# Altium schematic sheet Sheet1.SchDoc
size A4
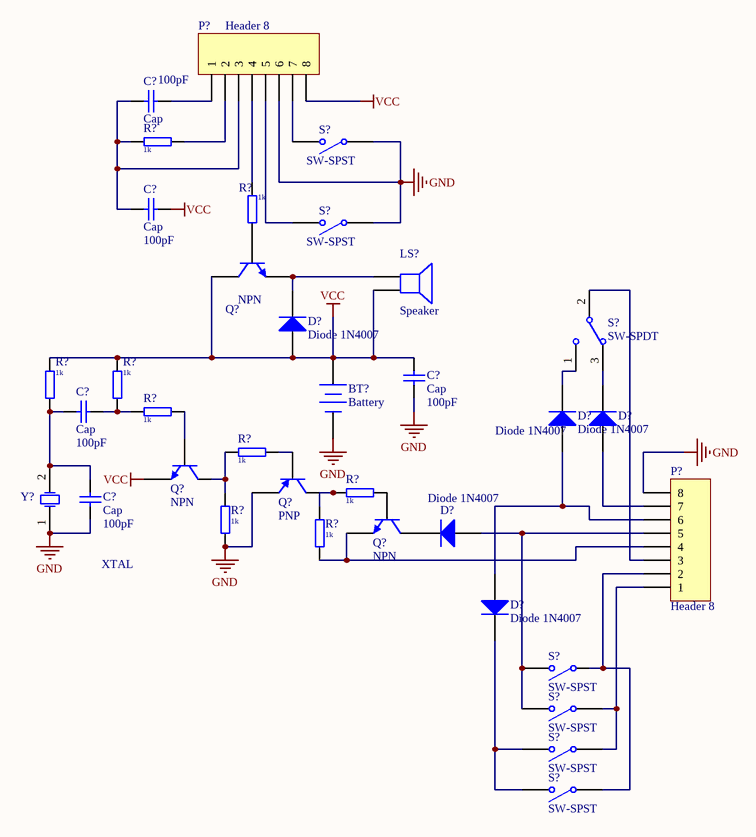
[diagram p0: Sheet1.SchDoc]

## Parts
(Parts that share a designator on the sheet are numbered #1, #2 ... from top to bottom, then left to right.)
BT?  Battery  [BAT-2]
C?#1  Cap  value 100pF  [RAD-0.3]
C?#2  Cap  value 100pF  [RAD-0.3]
C?#3  Cap  value 100pF  [RAD-0.3]
C?#4  Cap  value 100pF  [RAD-0.3]
C?#5  Cap  value 100pF  [RAD-0.3]
D?#1  Diode 1N4007  [DO-41]
D?#2  Diode 1N4007  [DO-41]
D?#3  Diode 1N4007  [DO-41]
D?#4  Diode 1N4007  [DO-41]
D?#5  Diode 1N4007  [DO-41]
LS?  Speaker  [PIN2]
P?#1  Header 8  [HDR1X8]
P?#2  Header 8  [HDR1X8]
Q?#1  NPN  [TO-226-AA]
Q?#2  NPN  [TO-226-AA]
Q?#3  PNP  [SOT-23B_L]
Q?#4  NPN  [TO-226-AA]
R?#1  1k  [R0805]
R?#2  1k  [R0805]
R?#3  1k  [R0805]
R?#4  1k  [R0805]
R?#5  1k  [R0805]
R?#6  1k  [R0805]
R?#7  1k  [R0805]
R?#8  1k  [R0805]
R?#9  1k  [R0805]
S?#1  SW-SPST  [SPST-2]
S?#2  SW-SPST  [SPST-2]
S?#3  SW-SPDT  [TL36WW15050]
S?#4  SW-SPST  [SPST-2]
S?#5  SW-SPST  [SPST-2]
S?#6  SW-SPST  [SPST-2]
S?#7  SW-SPST  [SPST-2]
Y?  XTAL  [R38]

## Nets
GND: BT?.2(-) C?#3.1 C?#5.1 P?#1.6 P?#2.8 Q?#3.3(E) R?#8.1 S?#1.1(COMMON) S?#2.1(COMMON) Y?.1(OSC1)
VCC: BT?.1(+) C?#2.2 C?#3.2 D?#1.1(A) LS?.2 P?#1.8 Q?#1.1(C) Q?#2.3(E) R?#3.2 R?#4.2
NetC?#1_1: C?#1.1 C?#2.1 P?#1.3 R?#1.2
NetC?#1_2: C?#1.2 P?#1.1
NetC?#4_1: C?#4.1 R?#4.1 R?#5.2
NetC?#4_2: C?#4.2 C?#5.2 R?#3.1 Y?.2(OSC2)
NetD?#1_2: D?#1.2(K) LS?.1 Q?#1.3(E)
NetD?#2_1: D?#2.1(A) D?#5.1(A) P?#2.6
NetD?#2_2: D?#2.2(K) S?#3.1
NetD?#3_1: D?#3.1(A) P?#2.7
NetD?#3_2: D?#3.2(K) S?#3.3
NetD?#4_1: D?#4.1(A) P?#2.5 S?#4.2(NO) S?#5.2(NO)
NetD?#5_2: D?#5.2(K) S?#6.2(NO) S?#7.2(NO)
NetP?#1_2: P?#1.2 R?#1.1
NetP?#1_4: P?#1.4 R?#2.2
NetP?#1_5: P?#1.5 S?#2.2(NO)
NetP?#1_7: P?#1.7 S?#1.2(NO)
NetP?#2_1: P?#2.1 S?#5.1(COMMON) S?#6.1(COMMON)
NetP?#2_2: P?#2.2 S?#4.1(COMMON) S?#7.1(COMMON)
NetP?#2_3: P?#2.3 S?#3.2
NetP?#2_4: P?#2.4 Q?#4.3(E) R?#9.2
NetQ?#1_2: Q?#1.2(B) R?#2.1
NetQ?#2_1: Q?#2.1(C) R?#6.2 R?#8.2
NetQ?#2_2: Q?#2.2(B) R?#5.1
NetQ?#3_1: Q?#3.1(C) R?#7.2 R?#9.1
NetQ?#3_2: Q?#3.2(B) R?#6.1
NetQ?#4_2: Q?#4.2(B) R?#7.1

Not connected (* = marked no-connect by the designer): D?#4 2(K); Q?#4 1(C)

## Library data of the parts
BT? = Battery: Multicell Battery; Published: 24-Mar-1999; LatestRevisionDate: 17-Jul-2002; LatestRevisionNote: Re-released for DXP Platform.; PackageReference: BAT-2; Publisher: Altium Limited; PackageDescription: Battery; 2 Leads
C?#1-C?#5 = Cap: Capacitor; Published: 8-Jun-2000; LatestRevisionDate: 17-Jul-2002; LatestRevisionNote: Re-released for DXP Platform.; PackageReference: RAD-0.3; Publisher: Altium Limited; PackageDescription: Radial Cap, Thru-Hole; 2 Leads; 0.3 in Pin Spacing
D?#1-D?#5 = Diode 1N4007: 1 Amp General Purpose Rectifier; Published: 8-Jun-2000; LatestRevisionDate: 17-Jul-2002; LatestRevisionNote: Re-released for DXP Platform.; DatasheetVersion: 1998; PackageVersion: Aug-1999; PackageReference: DO-41; Publisher: Altium Limited; PackageDescription: Diode, Axial; Body 5.2 x 2.7 mm (LxDia. max), Lead Dia. 0.86 mm (max); Code_JEDEC: DO-204-AL; ComponentLink1Description: Manufacturer Link; ComponentLink1URL: http://www.fairchildsemi.com/; ComponentLink2Description: Datasheet; ComponentLink2URL: http://www.fairchildsemi.com/ds/1N%2F1N4001.pdf
LS? = Speaker: Loudspeaker; Published: 24-Mar-1999; LatestRevisionDate: 17-Jul-2002; LatestRevisionNote: Re-released for DXP Platform.; PackageReference: PIN2; Publisher: Altium Limited
P?#1 P?#2 = Header 8: Header, 8-Pin; LatestRevisionDate: 17-Jul-2002; LatestRevisionNote: Re-released for DXP Platform.; Publisher: Altium Limited
Q?#1 Q?#2 Q?#4 = NPN: NPN Bipolar Transistor; Published: 8-Jun-2000; LatestRevisionDate: 17-Jul-2002; LatestRevisionNote: Re-released for DXP Platform.; PackageReference: TO-226-AA; Publisher: Altium Limited; PackageDescription: TO, Flat Index; 3 In-Line, Axial Leads; Body Dia. 4.8mm; Leads 0.55 x 0.51 mm (max); Code_JEDEC: TO-226-AA
Q?#3 = PNP: PNP Bipolar Transistor; Published: 8-Jun-2000; LatestRevisionDate: 29-May-2009; LatestRevisionNote: IPC-7351 Footprint Added.; PackageVersion: Aug-1999; PackageReference: SOT-23B; Publisher: Altium Limited; PackageDescription: 3-Pin SOT-23 Package 0.95 mm Pitch, 2.4 mm Lead Span
R?#1-R?#9 = R-0805: SMD 0805 0.1W 5% 150V; Price: 0.017; Value: 1k
S?#1 S?#2 S?#4-S?#7 = SW-SPST: Single-Pole, Single-Throw Switch; Published: 24-Mar-1999; LatestRevisionDate: 17-Jul-2002; LatestRevisionNote: Re-released for DXP Platform.; PackageReference: SPST-2; Publisher: Altium Limited; PackageDescription: Switch; 2 Leads
S?#3 = SW-SPDT: SPDT Subminiature Toggle Switch, Right Angle Mounting, Vertical Actuation; Published: 24-Mar-1999; LatestRevisionDate: 17-Dec-2003; LatestRevisionNote: Schematic revised, PCB Footprint replaced.; DatasheetVersion: 05-Dec-2000; PackageReference: TL36WW15050; Publisher: Altium Limited; PackageDescription: Switch; 4 Leads; ComponentLink1Description: Manufacturer Link; ComponentLink1URL: http://www.apem.com
Y? = XTAL: Crystal Oscillator; Published: 8-Jun-2000; LatestRevisionDate: 17-Jul-2002; LatestRevisionNote: Re-released for DXP Platform.; PackageReference: R38; Publisher: Altium Limited; PackageDescription: Crystal, Thru-Hole; 2 Leads; Body 3.1 x 8.2 mm (Dia.xH)